# EAGLE schematic onion_ws2812 (EAGLE 7.7.0)
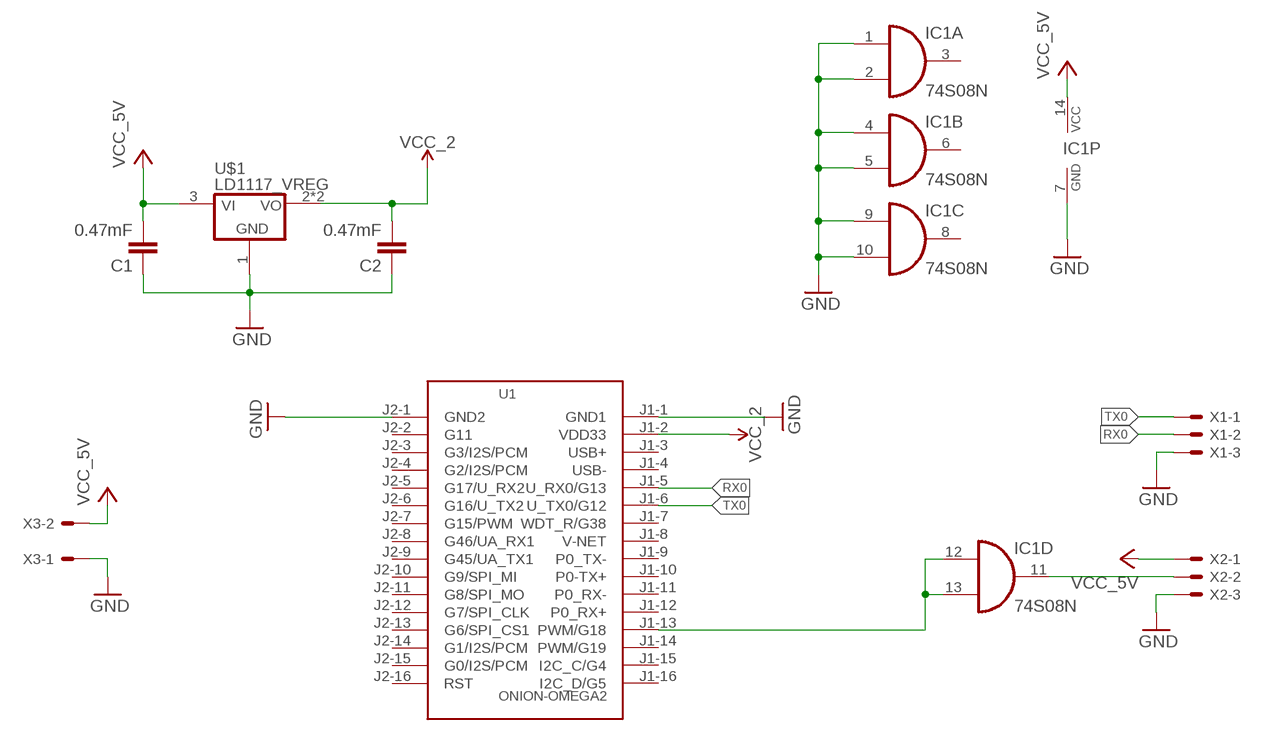
[diagram p0: schematic, sheet 1]

## Parts
C1  0.47mF  C-1206  [C1206]
C2  0.47mF  C-1206  [C1206]
IC1  74S08N  [DIL14]
U1  ONION-OMEGA2  [ONION-2MM-2X16]
U$1  LD1117_VREG  [SOT-223]
X1  KK-156-3  [KK-156-3]
X2  KK-156-3  [KK-156-3]
X3  KK-156-2  [KK-156-2]

## Nets
GND: C1.1 C2.1 IC1.1(A:I0) IC1.2(A:I1) IC1.4(B:I0) IC1.5(B:I1) IC1.7(P:GND) IC1.9(C:I0) IC1.10(C:I1) U1.J1-1(GND1) U1.J2-1(GND2) U$1.1(GND) X1.3 X2.3 X3.1
N$1: IC1.12(D:I0) IC1.13(D:I1) U1.J1-13(PWM/G18)
N$3: IC1.11(D:O) X2.2
RX0: U1.J1-5(U_RX0/G13) X1.2
TX0: U1.J1-6(U_TX0/G12) X1.1
VCC: C1.2 IC1.14(P:VCC) U$1.3(VIN) X2.1 X3.2 ; supply symbol labelled VCC_5V
VCC_2: C2.2 U1.J1-2(VDD33) U$1.2(VOUT) U$1.TAB(VOUT)
Unconnected: IC1.3(A:O) IC1.6(B:O) IC1.8(C:O) U1.J1-3(USB+) U1.J1-4(USB-) U1.J1-7(WDT_R/G38) U1.J1-8(V-NET) U1.J1-9(P0_TX-) U1.J1-10(P0-TX+) U1.J1-11(P0_RX-) U1.J1-12(P0_RX+) U1.J1-14(PWM/G19) U1.J1-15(I2C_C/G4) U1.J1-16(I2C_D/G5) U1.J2-2(G11) U1.J2-3(G3/I2S/PCM) U1.J2-4(G2/I2S/PCM) U1.J2-5(G17/U_RX2) U1.J2-6(G16/U_TX2) U1.J2-7(G15/PWM) U1.J2-8(G46/UA_RX1) U1.J2-9(G45/UA_TX1) U1.J2-10(G9/SPI_MI) U1.J2-11(G8/SPI_MO) U1.J2-12(G7/SPI_CLK) U1.J2-13(G6/SPI_CS1) U1.J2-14(G1/I2S/PCM) U1.J2-15(G0/I2S/PCM) U1.J2-16(RST)

## Library data of the parts
C1 C2 = quantum-sensor:C: Capacitor
IC1 = 74xx-eu:74*08: Quad 2-input AND gate
U1 = 1484203861886-plan44:ONION-OMEGA2: Onion Omega
U$1 = stm32__1:LD1117_VREG
X1 X2 = con-molex:KK-156-3: KK 156 HEADER Source: http://www.molex.com/pdm_docs/sd/026604100_sd.pdf; OC_FARNELL: unknown; OC_NEWARK: unknown
X3 = con-molex:KK-156-2: KK 156 HEADER Source: http://www.molex.com/pdm_docs/sd/026604100_sd.pdf; OC_FARNELL: unknown; OC_NEWARK: unknown